# Altium project STM32F7 Dev.PrjPcb (part 1 of 2)
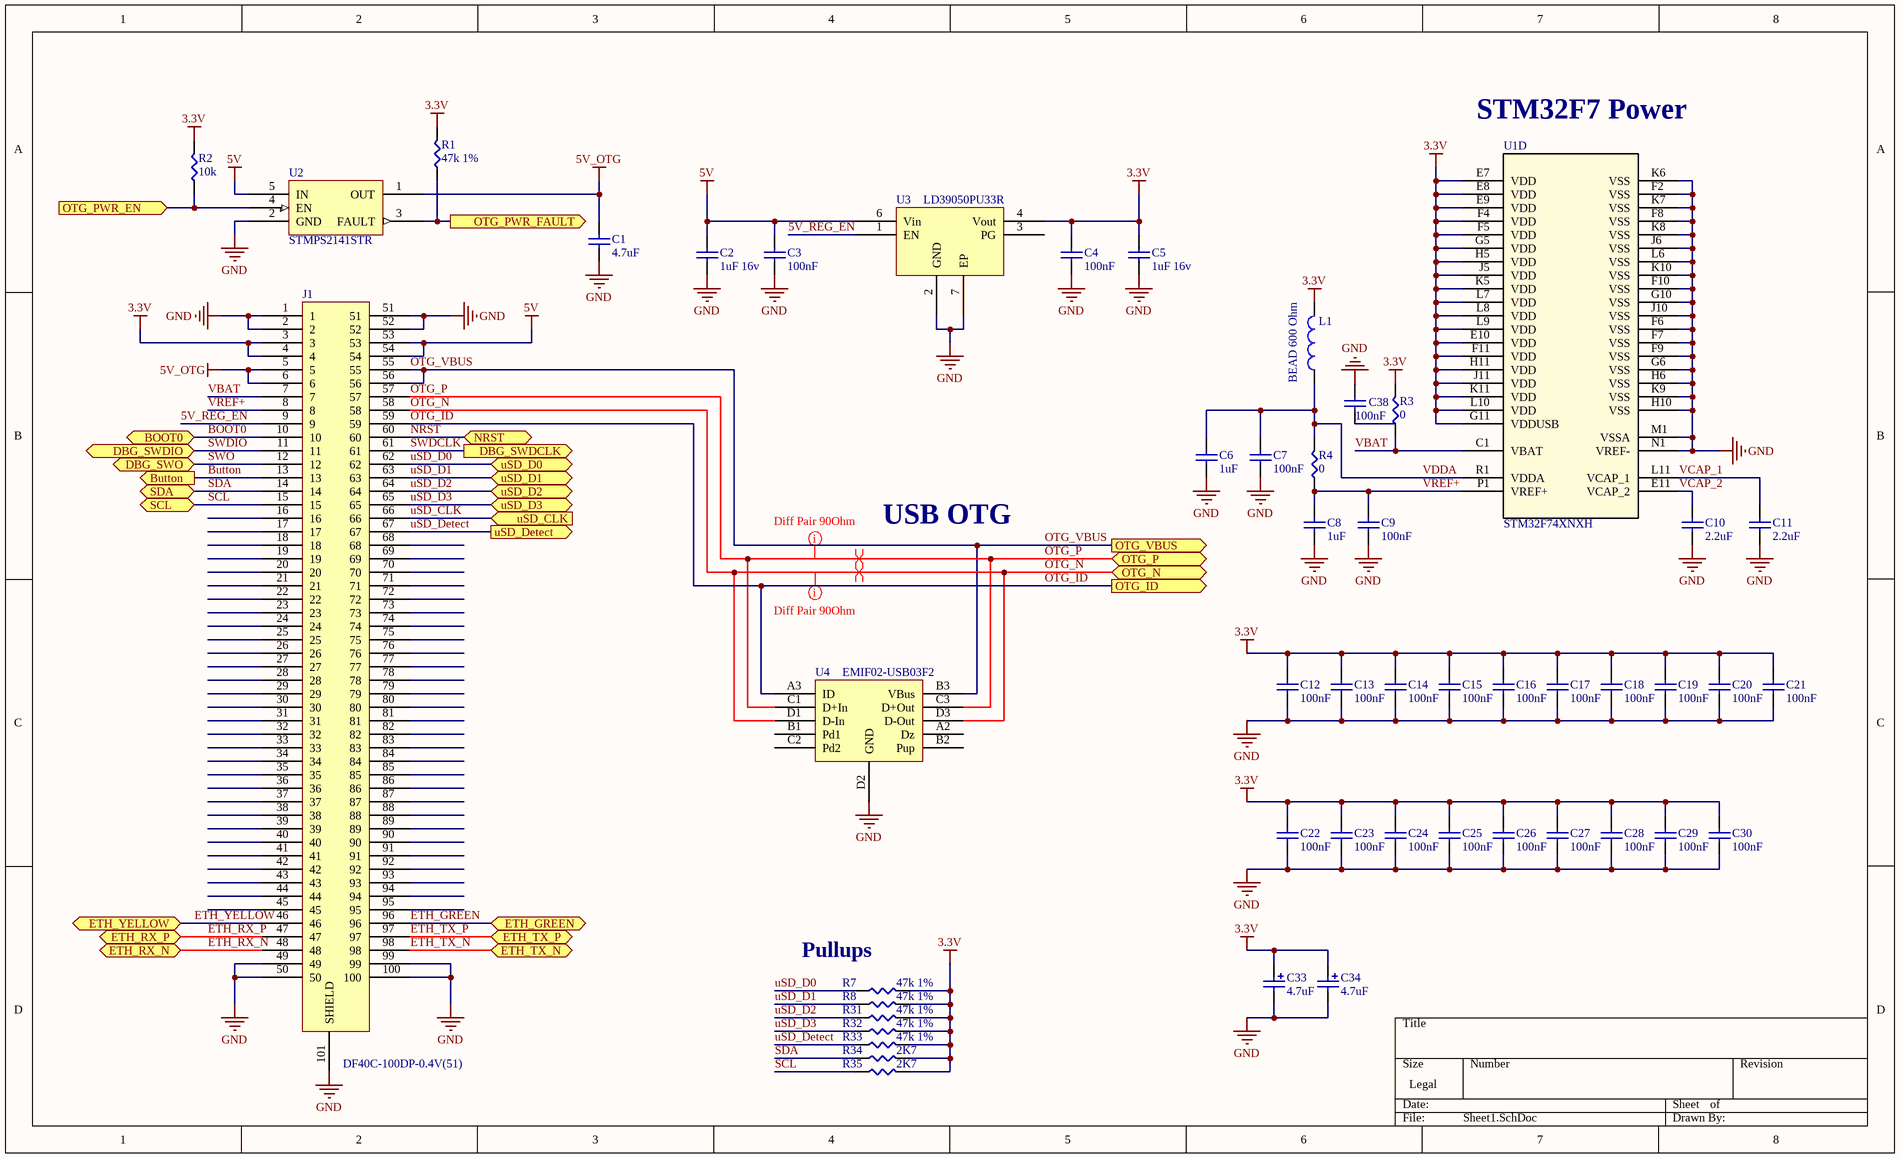
[diagram p0: Sheet1.SchDoc]
3 sheets, 98 parts. Net scope: flat (ports and power ports of the same name join across sheets).
Board file: PCB1.PcbDoc
Sheets:
  Sheet1.SchDoc
  Sheet2.SchDoc
  Sheet3.SchDoc

## Sheet Sheet1.SchDoc
size Legal

### Parts
C1  4.7uF  [CAP0603X055M]
C2  1uF 16v  [CAP0603X055M]
C3  100nF  [CAP0402X04M]
C4  100nF  [CAP0402X04M]
C5  1uF 16v  [CAP0603X055M]
C6  1uF  [CAP0402X04M]
C7  100nF  [CAP0402X04M]
C8  1uF  [CAP0402X04M]
C9  100nF  [CAP0402X04M]
C10  2.2uF  [CAP0402X04ROUND]
C11  2.2uF  [CAP0402X04ROUND]
C12  100nF  [CAP0402X04ROUND]
C13  100nF  [CAP0402X04ROUND]
C14  100nF  [CAP0402X04ROUND]
C15  100nF  [CAP0402X04ROUND]
C16  100nF  [CAP0402X04ROUND]
C17  100nF  [CAP0402X04ROUND]
C18  100nF  [CAP0402X04ROUND]
C19  100nF  [CAP0402X04ROUND]
C20  100nF  [CAP0402X04ROUND]
C21  100nF  [CAP0402X04ROUND]
C22  100nF  [CAP0402X04ROUND]
C23  100nF  [CAP0402X04ROUND]
C24  100nF  [CAP0402X04ROUND]
C25  100nF  [CAP0402X04ROUND]
C26  100nF  [CAP0402X04ROUND]
C27  100nF  [CAP0402X04ROUND]
C28  100nF  [CAP0402X04ROUND]
C29  100nF  [CAP0402X04ROUND]
C30  100nF  [CAP0402X04ROUND]
C33  4.7uF  [CAPPOL0805X07N]
C34  4.7uF  [CAPPOL0805X07N]
C38  100nF  [CAP0402X04M]
J1  DF40C-100DP-0.4V(51)  [DF40C-100DP-0.4V(51)]
L1  BEAD 600 Ohm  [IND0603X055M]
R1  47k 1%  [RES0402X04M]
R2  10k  [RES0402X04M]
R3  0  [RES0805X07M]
R4  0  [RES0805X07M]
R7  47k 1%  [RES0402X04M]
R8  47k 1%  [RES0402X04M]
R31  47k 1%  [RES0402X04M]
R32  47k 1%  [RES0402X04M]
R33  47k 1%  [RES0402X04M]
R34  2K7  [RES0402X04M]
R35  2K7  [RES0402X04M]
U1  STM32F74XNXH  [TFBGA-216_13X13]  (part D of 5)
U2  STMPS2141STR  [SOT95P280X145-5N]
U3  LD39050PU33R  [LD39050]
U4  EMIF02-USB03F2  [EMIF02-USB03F2]

### Ports
BOOT0 (bidir), Button (out), DBG_SWDCLK (out), DBG_SWDIO (bidir), DBG_SWO (bidir), ETH_GREEN (bidir), ETH_RX_N (bidir), ETH_RX_P (bidir), ETH_TX_N (bidir), ETH_TX_P (bidir), ETH_YELLOW (bidir), NRST (bidir), OTG_ID (out), OTG_N (bidir), OTG_P (bidir), OTG_PWR_EN (in), OTG_PWR_FAULT (out), OTG_VBUS (out), SCL (bidir), SDA (bidir), uSD_CLK (in), uSD_D0 (bidir), uSD_D1 (bidir), uSD_D2 (bidir), uSD_D3 (bidir), uSD_Detect (out)

### Nets
3.3V: C4.2 C5.2 C12.2 C13.2 C14.2 C15.2 C16.2 C17.2 C18.2 C19.2 C20.2 C21.2 C22.2 C23.2 C24.2 C25.2 C26.2 C27.2 C28.2 C29.2 C30.2 C33.1 C34.1 J1.3 J1.4 L1.2 R1.2 R2.2 R3.2 R7.2 R8.2 R31.2 R32.2 R33.2 R34.2 R35.2 U1.E7(VDD) U1.E8(VDD) U1.E9(VDD) U1.E10(VDD) U1.F4(VDD) U1.F5(VDD) U1.F11(VDD) U1.G5(VDD) U1.G11(VDDUSB) U1.H5(VDD) U1.H11(VDD) U1.J5(VDD) U1.J11(VDD) U1.K5(VDD) U1.K11(VDD) U1.L7(VDD) U1.L8(VDD) U1.L9(VDD) U1.L10(VDD) U3.4(Vout)
5V: C2.2 C3.2 J1.53 J1.54 U2.5(IN) U3.6(Vin)
5V_OTG: C1.2 J1.5 J1.6 U2.1(OUT)
GND: C1.1 C2.1 C3.1 C4.1 C5.1 C6.1 C7.1 C8.1 C9.1 C10.1 C11.1 C12.1 C13.1 C14.1 C15.1 C16.1 C17.1 C18.1 C19.1 C20.1 C21.1 C22.1 C23.1 C24.1 C25.1 C26.1 C27.1 C28.1 C29.1 C30.1 C33.2 C34.2 C38.2 J1.1 J1.2 J1.49 J1.50 J1.51 J1.52 J1.99 J1.100 J1.101(SHIELD) U1.F2(VSS) U1.F6(VSS) U1.F7(VSS) U1.F8(VSS) U1.F9(VSS) U1.F10(VSS) U1.G6(VSS) U1.G10(VSS) U1.H6(VSS) U1.H10(VSS) U1.J6(VSS) U1.J10(VSS) U1.K6(VSS) U1.K7(VSS) U1.K8(VSS) U1.K9(VSS) U1.K10(VSS) U1.L6(VSS) U1.M1(VSSA) U1.N1(VREF-) U2.2(GND) U3.2(GND) U3.7(EP) U4.D2(GND)
5V_REG_EN: J1.9 U3.1(EN)
BOOT0: J1.10 ; port BOOT0
Button: J1.13 ; port Button
ETH_GREEN: J1.96 ; port ETH_GREEN
ETH_RX_N: J1.48 ; port ETH_RX_N
ETH_RX_P: J1.47 ; port ETH_RX_P
ETH_TX_N: J1.98 ; port ETH_TX_N
ETH_TX_P: J1.97 ; port ETH_TX_P
ETH_YELLOW: J1.46 ; port ETH_YELLOW
NRST: J1.60 ; port NRST
OTG_ID: J1.59 U4.A3(ID) ; port OTG_ID
OTG_N: J1.58 U4.D1(D-In) U4.D3(D-Out) ; port OTG_N
OTG_P: J1.57 U4.C1(D+In) U4.C3(D+Out) ; port OTG_P
OTG_PWR_EN: R2.1 U2.4(EN) ; port OTG_PWR_EN
OTG_PWR_FAULT: R1.1 U2.3(FAULT) ; port OTG_PWR_FAULT
OTG_VBUS: J1.55 J1.56 U4.B3(VBus) ; port OTG_VBUS
SCL: J1.15 R35.1 ; port SCL
SDA: J1.14 R34.1 ; port SDA
SWDCLK: J1.61 ; port DBG_SWDCLK
SWDIO: J1.11 ; port DBG_SWDIO
SWO: J1.12 ; port DBG_SWO
uSD_CLK: J1.66 ; port uSD_CLK
uSD_D0: J1.62 R7.1 ; port uSD_D0
uSD_D1: J1.63 R8.1 ; port uSD_D1
uSD_D2: J1.64 R31.1 ; port uSD_D2
uSD_D3: J1.65 R32.1 ; port uSD_D3
uSD_Detect: J1.67 R33.1 ; port uSD_Detect
VBAT: J1.7 R3.1 U1.C1(VBAT)
VCAP_1: C11.2 U1.L11(VCAP_1)
VCAP_2: C10.2 U1.E11(VCAP_2)
VDDA: C6.2 C7.2 L1.1 R4.2 U1.R1(VDDA)
VREF+: C8.2 C9.2 J1.8 R4.1 U1.P1(VREF+)

Not connected (* = marked no-connect by the designer): C38 1; J1 16 17 18 19 20 21 22 23 24 25 26 27 28 29 30 31 32 33 34 35 36 37 38 39 40 41 42 43 44 45 68 69 70 71 72 73 74 75 76 77 78 79 80 81 82 83 84 85 86 87 88 89 90 91 92 93 94 95; U3 3(PG); U4 A2(Dz) B1(Pd1) B2(Pup) C2(Pd2)

### Layout directives
differential pair: OTG_N, OTG_P
DiffPair90: Undefined: OTG_N, OTG_P

### Notes on the sheet
- STM32F7 Power
- USB OTG
- Pullups

### Library data of the parts
C1 = CL10A475MP5LNNC: CAP CER 4.7UF 10V X5R 0603; Manufacturer: Samsung Electro-Mechanics America, Inc.; Capacitance: 4.7µF; Tolerance: ±20%; Supplier 1: Digi-Key; Manufacturer Part Number: CL10A475MP5LNNC; RoHS: RoHS Compliant; Category: Capacitors; Stock 1: 31898; Pricing 1: 1=0.1, 10=0.074, 25=0.0544, 50=0.0422, 100=0.0349, 250=0.02892, 500=0.0245, 1000=0.02028 (USD); Packaging: Cut Tape (CT); Part Status: Active; Voltage - Rated: 10V; Temperature Coefficient: X5R; Operating Temperature: -55°C ~ 85°C; Features: Low Profile; Ratings: -; Applications: General Purpose; Failure Rate: *; Mounting Type: Surface Mount, MLCC; Package / Case: 0603 (1608 Metric); Size / Dimension: 0.063" L x 0.031" W (1.60mm x 0.80mm); Height - Seated (Max): -; Thickness (Max): 0.022" (0.55mm); Lead Spacing: -; Lead Style: -; ComponentLink1URL: http://www.samsungsem.com/kr/support/library/product-catalog/__icsFiles/afieldfile/2016/09/27/MLCC.pdf; ComponentLink1Description: http://www.samsungsem.com/kr/support/library/product-catalog/__icsFiles/afieldfile/2016/09/27/MLCC.pdf; Supplier Part Number 1: 1276-6684-1-ND
C2 C5 = CC0603ZRY5V7BB105: CAP CER 1UF 16V Y5V 0603; Manufacturer: Yageo; Capacitance: 1µF; Tolerance: -20%, +80%; Temperature Coefficient: Y5V (F); Supplier 1: Digi-Key; Manufacturer Part Number: CC0603ZRY5V7BB105; RoHS: RoHS Compliant; Category: Capacitors; Stock 1: 840235; Pricing 1: 1=0.1, 10=0.033, 25=0.0236, 100=0.0152, 250=0.01248, 500=0.01068, 1000=0.00832 (USD); Packaging: Cut Tape (CT); Part Status: Active; Voltage - Rated: 16V; Operating Temperature: -30°C ~ 85°C; Features: -; Ratings: -; Applications: General Purpose; Failure Rate: -; Mounting Type: Surface Mount, MLCC; Package / Case: 0603 (1608 Metric); Size / Dimension: 0.063" L x 0.031" W (1.60mm x 0.80mm); Height - Seated (Max): -; Thickness (Max): 0.035" (0.90mm); Lead Spacing: -; Lead Style: -; ComponentLink1URL: http://www.yageo.com/documents/recent/UPY-GPHC_Y5V_6.3V-to-50V_6.pdf; ComponentLink1Description: http://www.yageo.com/documents/recent/UPY-GPHC_Y5V_6.3V-to-50V_6.pdf; Supplier Part Number 1: 311-1372-1-ND
C3 C4 C7 C9 C12-C30 C38 = GRM155R71C104KA88J: CAP CER 0.1UF 16V X7R 0402; Manufacturer: Murata Electronics North America; Capacitance: 0.10µF; Tolerance: ±10%; Supplier 1: Digi-Key; Manufacturer Part Number: GRM155R71C104KA88J; RoHS: RoHS Compliant; Category: Capacitors; Stock 1: 28696221; Pricing 1: 1=0.1, 10=0.012, 50=0.0066, 100=0.0055, 250=0.00452, 500=0.00386, 1000=0.003, 5000=0.0025, 10000=0.0023 (USD); Packaging: Cut Tape (CT); Part Status: Active; Voltage - Rated: 16V; Temperature Coefficient: X7R; Operating Temperature: -55°C ~ 125°C; Features: -; Ratings: -; Applications: General Purpose; Failure Rate: *; Mounting Type: Surface Mount, MLCC; Package / Case: 0402 (1005 Metric); Size / Dimension: 0.039" L x 0.020" W (1.00mm x 0.50mm); Height - Seated (Max): -; Thickness (Max): 0.022" (0.55mm); Lead Spacing: -; Lead Style: *; ComponentLink1URL: http://www.murata.com/~/media/webrenewal/support/library/catalog/products/capacitor/mlcc/c02e.pdf; ComponentLink1Description: http://www.murata.com/~/media/webrenewal/support/library/catalog/products/capacitor/mlcc/c02e.pdf; Supplier Part Number 1: 490-6328-1-ND
C6 C8 = GRM155R60J105KE19D: CAP CER 1UF 6.3V X5R 0402; Manufacturer: Murata Electronics North America; Capacitance: 1µF; Tolerance: ±10%; Supplier 1: Digi-Key; Manufacturer Part Number: GRM155R60J105KE19D; RoHS: RoHS Compliant; Category: Capacitors; Stock 1: 3970482; Pricing 1: 1=0.1, 10=0.021, 50=0.0114, 100=0.0096, 250=0.00784, 500=0.0067, 1000=0.00522, 5000=0.00435 (USD); Packaging: Cut Tape (CT); Part Status: Active; Voltage - Rated: 6.3V; Temperature Coefficient: X5R; Operating Temperature: -55°C ~ 85°C; Features: -; Ratings: -; Applications: General Purpose; Failure Rate: *; Mounting Type: Surface Mount, MLCC; Package / Case: 0402 (1005 Metric); Size / Dimension: 0.039" L x 0.020" W (1.00mm x 0.50mm); Height - Seated (Max): -; Thickness (Max): 0.022" (0.55mm); Lead Spacing: -; Lead Style: -; ComponentLink1URL: http://www.murata.com/~/media/webrenewal/support/library/catalog/products/capacitor/mlcc/c02e.pdf; ComponentLink1Description: http://www.murata.com/~/media/webrenewal/support/library/catalog/products/capacitor/mlcc/c02e.pdf; Supplier Part Number 1: 490-1320-1-ND
C10 C11 = 04026D225KAT2A: CAP CER 2.2UF 6.3V X5R 0402; Manufacturer: AVX Corporation; Capacitance: 2.2µF; Tolerance: ±10%; Supplier 1: Digi-Key; Manufacturer Part Number: 04026D225KAT2A; RoHS: RoHS Compliant; Category: Capacitors; Stock 1: 639807; Pricing 1: 1=0.1, 10=0.075, 25=0.0544, 50=0.0424, 100=0.0351, 250=0.029, 500=0.02458, 1000=0.02035, 5000=0.01733 (USD); Packaging: Cut Tape (CT); Part Status: Active; Voltage - Rated: 6.3V; Temperature Coefficient: X5R; Operating Temperature: -55°C ~ 85°C; Features: -; Ratings: -; Applications: General Purpose; Failure Rate: *; Mounting Type: Surface Mount, MLCC; Package / Case: 0402 (1005 Metric); Size / Dimension: 0.039" L x 0.020" W (1.00mm x 0.50mm); Height - Seated (Max): -; Thickness (Max): 0.022" (0.56mm); Lead Spacing: -; Lead Style: -; ComponentLink1URL: http://datasheets.avx.com/cx5r.pdf; ComponentLink1Description: http://datasheets.avx.com/cx5r.pdf; Supplier Part Number 1: 478-7885-1-ND
C33 C34 = F921A475MPA: CAP TANT 4.7UF 10V 20% 0805; Manufacturer: AVX Corporation; Manufacturer Size Code: P; Capacitance: 4.7µF; Type: Molded; ESR (Equivalent Series Resistance): 6 Ohm; Supplier 1: Digi-Key; Manufacturer Part Number: F921A475MPA; RoHS: RoHS Compliant; Category: Capacitors; Stock 1: 10365; Pricing 1: 1=0.29, 10=0.204, 25=0.1672, 50=0.1426, 100=0.1223, 250=0.10192, 500=0.09174, 1000=0.07746 (USD); Packaging: Cut Tape (CT); Part Status: Active; Tolerance: ±20%; Voltage - Rated: 10V; Operating Temperature: -55°C ~ 125°C; Lifetime @ Temp.: -; Mounting Type: Surface Mount; Package / Case: 0805 (2012 Metric); Size / Dimension: 0.079" L x 0.049" W (2.00mm x 1.25mm); Height - Seated (Max): 0.039" (1.00mm); Lead Spacing: -; Features: General Purpose; Failure Rate: -; ComponentLink1URL: http://datasheets.avx.com/f92.pdf; ComponentLink1Description: http://datasheets.avx.com/f92.pdf; Supplier Part Number 1: 478-8125-1-ND
J1 = DF40C-100DP-0.4V(51): CONN HDR 100POS 0.4MM SMD GOLD; Manufacturer: Hirose Electric Co Ltd; Connector Type: Plug, Outer Shroud Contacts; Number of Positions: 100; Pitch: 0.016" (0.40mm); Mated Stacking Heights: 1.5mm, 2mm, 2.5mm, 3mm, 3.5mm, 4mm; Supplier 1: Digi-Key; Manufacturer Part Number: DF40C-100DP-0.4V(51); RoHS: RoHS Compliant; Category: Connectors, Interconnects; Stock 1: 15710; Pricing 1: 1=1.66, 10=1.509, 25=1.4168, 50=1.3552, 100=1.2936, 250=1.1704, 500=1.078, 1000=0.924, 2500=0.8624 (USD); Packaging: Cut Tape (CT); Part Status: Active; Number of Rows: 2; Mounting Type: Surface Mount; Features: Solder Retention; Contact Finish: Gold; Contact Finish Thickness: 2µin (0.05µm); Height Above Board: 0.045" (1.14mm); ComponentLink1URL: https://www.hirose.com/product/download/?distributor=digikey&type=2d&lang=en&num=DF40C-100DP-0.4V(51); ComponentLink1Description: https://www.hirose.com/product/download/?distributor=digikey&type=2d&lang=en&num=DF40C-100DP-0.4V(51); Supplier Part Number 1: H11614CT-ND
L1 = BK1608HW601-T: FERRITE BEAD 600 OHM 0603 1LN; Manufacturer: Taiyo Yuden; Number of Lines: 1; Impedance @ Frequency: 600 Ohm @ 100MHz; Current Rating (Max): 300mA; DC Resistance (DCR) (Max): 400 mOhm; Supplier 1: Digi-Key; Manufacturer Part Number: BK1608HW601-T; RoHS: RoHS Compliant; Category: Filters; Stock 1: 46168; Pricing 1: 1=0.1, 10=0.059, 50=0.0474, 100=0.0426, 250=0.0312, 500=0.0227, 1000=0.02223 (USD); Packaging: Cut Tape (CT); Part Status: Active; Filter Type: -; Ratings: -; Operating Temperature: -55°C ~ 125°C; Package / Case: 0603 (1608 Metric); Mounting Type: Surface Mount; Height (Max): 0.037" (0.95mm); Size / Dimension: 0.063" L x 0.031" W (1.60mm x 0.80mm); ComponentLink1URL: http://ds.yuden.co.jp/TYCOMPAS/ut/detail.do?productNo=BK1608HW601-T&fileName=BK1608HW601-T_SS&mode=specSheetDownload; ComponentLink1Description: http://ds.yuden.co.jp/TYCOMPAS/ut/detail.do?productNo=BK1608HW601-T&fileName=BK1608HW601-T_SS&mode=specSheetDownload; Supplier Part Number 1: 587-1879-1-ND
R1 R7 R8 R31-R33 = ERJ-2RKF4702X: RES SMD 47K OHM 1% 1/10W 0402; Manufacturer: Panasonic Electronic Components; Power (Watts): 0.1W, 1/10W; Temperature Coefficient: ±100ppm/°C; Supplier 1: Digi-Key; Manufacturer Part Number: ERJ-2RKF4702X; RoHS: RoHS Compliant; Category: Resistors; Stock 1: 296471; Pricing 1: 1=0.1, 50=0.015, 100=0.011, 250=0.0084, 500=0.00674, 1000=0.00496, 5000=0.00355 (USD); Packaging: Cut Tape (CT); Part Status: Active; Resistance (Ohms): 47k; Tolerance: ±1%; Composition: Thick Film; Features: Automotive AEC-Q200; Operating Temperature: -55°C ~ 155°C; Package / Case: 0402 (1005 Metric); Supplier Device Package: 0402; Size / Dimension: 0.039" L x 0.020" W (1.00mm x 0.50mm); Height - Seated (Max): 0.016" (0.40mm); Number of Terminations: 2; Failure Rate: -; ComponentLink1URL: http://industrial.panasonic.com/www-cgi/jvcr13pz.cgi?E+PZ+3+AOA0002+ERJ2RKF4702X+7+WW; ComponentLink1Description: http://industrial.panasonic.com/www-cgi/jvcr13pz.cgi?E+PZ+3+AOA0002+ERJ2RKF4702X+7+WW; Supplier Part Number 1: P47.0KLCT-ND
R2 = RC0402FR-0710KL: RES SMD 10K OHM 1% 1/16W 0402; Manufacturer: Yageo; Power (Watts): 0.063W, 1/16W; Temperature Coefficient: ±100ppm/°C; Supplier 1: Digi-Key; Manufacturer Part Number: RC0402FR-0710KL; RoHS: RoHS Compliant; Category: Resistors; Stock 1: 13115833; Pricing 1: 1=0.1, 10=0.013, 25=0.0096, 100=0.0054, 250=0.00412, 500=0.00328, 1000=0.00242, 2500=0.0021, 5000=0.00173 (USD); Packaging: Cut Tape (CT); Part Status: Active; Resistance (Ohms): 10k; Tolerance: ±1%; Composition: Thick Film; Features: Moisture Resistant; Operating Temperature: -55°C ~ 155°C; Package / Case: 0402 (1005 Metric); Supplier Device Package: 0402; Size / Dimension: 0.039" L x 0.020" W (1.00mm x 0.50mm); Height - Seated (Max): 0.016" (0.40mm); Number of Terminations: 2; Failure Rate: -; ComponentLink1URL: http://www.yageo.com/NewPortal/yageodocoutput?fileName=/pdf/R-Chip/PYu-RC_Group_51_RoHS_L_4.pdf; ComponentLink1Description: http://www.yageo.com/NewPortal/yageodocoutput?fileName=/pdf/R-Chip/PYu-RC_Group_51_RoHS_L_4.pdf; Supplier Part Number 1: 311-10.0KLRCT-ND
R3 R4 = RC0805JR-070RL: RES SMD 0.0 OHM JUMPER 1/8W 0805; Manufacturer: Yageo; Resistance (Ohms): 0.0; Power (Watts): 0.125W, 1/8W; Supplier 1: Digi-Key; Manufacturer Part Number: RC0805JR-070RL; RoHS: RoHS Compliant; Category: Resistors; Stock 1: 2486712; Pricing 1: 1=0.1, 10=0.018, 25=0.0128, 100=0.0073, 250=0.00556, 500=0.00444, 1000=0.00326, 2500=0.00283 (USD); Packaging: Cut Tape (CT); Part Status: Active; Tolerance: Jumper; Composition: Thick Film; Features: Moisture Resistant; Temperature Coefficient: -; Operating Temperature: -55°C ~ 155°C; Package / Case: 0805 (2012 Metric); Supplier Device Package: 0805; Size / Dimension: 0.079" L x 0.049" W (2.00mm x 1.25mm); Height - Seated (Max): 0.024" (0.60mm); Number of Terminations: 2; Failure Rate: -; ComponentLink1URL: http://www.yageo.com/NewPortal/yageodocoutput?fileName=/pdf/R-Chip/PYu-RC_Group_51_RoHS_L_4.pdf; ComponentLink1Description: http://www.yageo.com/NewPortal/yageodocoutput?fileName=/pdf/R-Chip/PYu-RC_Group_51_RoHS_L_4.pdf; Supplier Part Number 1: 311-0.0ARCT-ND
R34 R35 = ERJ-2RKF2701X: RES SMD 2.7K OHM 1% 1/10W 0402; Manufacturer: Panasonic Electronic Components; Power (Watts): 0.1W, 1/10W; Temperature Coefficient: ±100ppm/°C; Supplier 1: Digi-Key; Manufacturer Part Number: ERJ-2RKF2701X; RoHS: RoHS Compliant; Category: Resistors; Stock 1: 285382; Pricing 1: 1=0.1, 50=0.015, 100=0.011, 250=0.0084, 500=0.00674, 1000=0.00496, 5000=0.00355 (USD); Packaging: Cut Tape (CT); Part Status: Active; Resistance (Ohms): 2.7k; Tolerance: ±1%; Composition: Thick Film; Features: Automotive AEC-Q200; Operating Temperature: -55°C ~ 155°C; Package / Case: 0402 (1005 Metric); Supplier Device Package: 0402; Size / Dimension: 0.039" L x 0.020" W (1.00mm x 0.50mm); Height - Seated (Max): 0.016" (0.40mm); Number of Terminations: 2; Failure Rate: -; ComponentLink1URL: http://industrial.panasonic.com/www-cgi/jvcr13pz.cgi?E+PZ+3+AOA0002+ERJ2RKF2701X+7+WW; ComponentLink1Description: http://industrial.panasonic.com/www-cgi/jvcr13pz.cgi?E+PZ+3+AOA0002+ERJ2RKF2701X+7+WW; Supplier Part Number 1: P2.70KLCT-ND
U1 = STM32F74XNXH: Imported; Manufacturer Part Number: STM32F746NGH6; Vendor: STMicroelectronics; C: Copyright (C) 2016 Accelerated Designs. All rights reserved; Core Processor: ARM® Cortex®-M7; Core Size: 32-Bit; Speed: 216MHz; Connectivity: CAN, EBI/EMI, Ethernet, I²C, IrDA, LIN, SAI, SD, SPDIF-Rx, SPI, UART/USART, USB OTG; Peripherals: Brown-out Detect/Reset, DMA, I²S, LCD, POR, PWM, WDT; Number of I/O: 168; Program Memory Size: 1MB (1M x 8); Program Memory Type: FLASH; RAM Size: 320K x 8; Voltage - Supply (Vcc/Vdd): 1.7 V ~ 3.6 V; Data Converters: A/D 24x12b, D/A 2x12b; Oscillator Type: Internal; Copyright: Copyright (C) 2016 Accelerated Designs. All rights reserved; RefDes: RefDes; Type: Type; Value: Value; Supplier 1: Digi-Key; Manufacturer: STMicroelectronics; RoHS: RoHS Compliant; Category: Integrated Circuits (ICs); Stock 1: 825; Pricing 1: 1=17.07, 10=15.687, 100=13.2486, 500=11.7856 (USD); Packaging: Tray; Part Status: Active; EEPROM Size: -; Operating Temperature: -40°C ~ 85°C (TA); Package / Case: 216-TFBGA; Supplier Device Package: 216-TFBGA (13x13); ComponentLink1Description: http://www.st.com/content/ccc/resource/technical/document/datasheet/96/ed/61/9b/e0/6c/45/0b/DM00166116.pdf/files/DM00166116.pdf/jcr:content/translations/en.DM00166116.pdf; Supplier Part Number 1: 497-15818-ND
U2 = STMPS2141STR: IC PWR SWITCH 1CH 500MA SOT23-5; Manufacturer: STMicroelectronics; Switch Type: General Purpose; Number of Outputs: 1; Ratio - Input:Output: 1:1; Output Configuration: High Side; Output Type: N-Channel; Interface: On/Off; Voltage - Load: 2.7 V ~ 5.5 V; Voltage - Supply (Vcc/Vdd): Not Required; Rds On (Typ): 90 mOhm; Input Type: Non-Inverting; Fault Protection: Current Limiting (Fixed), Over Temperature, Reverse Current, UVLO; Supplier 1: Digi-Key; Manufacturer Part Number: STMPS2141STR; RoHS: RoHS Compliant; Category: Integrated Circuits (ICs); Stock 1: 9855; Pricing 1: 1=0.61, 10=0.521, 100=0.3893, 500=0.30592, 1000=0.23639 (USD); Packaging: Cut Tape (CT); Part Status: Active; Current - Output (Max): 500mA; Features: -; Operating Temperature: -40°C ~ 125°C (TJ); Package / Case: SC-74A, SOT-753; Supplier Device Package: SOT-23-5; ComponentLink1URL: http://www.st.com/content/ccc/resource/technical/document/datasheet/e8/d7/48/25/eb/87/45/b3/CD00167470.pdf/files/CD00167470.pdf/jcr:content/translations/en.CD00167470.pdf; ComponentLink1Description: http://www.st.com/content/ccc/resource/technical/document/datasheet/e8/d7/48/25/eb/87/45/b3/CD00167470.pdf/files/CD00167470.pdf/jcr:content/translations/en.CD00167470.pdf; Supplier Part Number 1: 497-6933-1-ND
U3 = LD39050PU33R: IC REG LDO 3.3V 0.5A 6DFN; Manufacturer: STMicroelectronics; Regulator Topology: Positive Fixed; Current - Output: 500mA; Voltage - Dropout (Typical): 0.2V @ 500mA; Number of Regulators: 1; Voltage - Input: Up to 5.5V; Supplier 1: Digi-Key; Manufacturer Part Number: LD39050PU33R; RoHS: RoHS Compliant; Category: Integrated Circuits (ICs); Stock 1: 4096; Pricing 1: 1=1.07, 10=0.957, 100=0.7462, 500=0.61646, 1000=0.48668 (USD); Packaging: Cut Tape (CT); Part Status: Active; Voltage - Output: 3.3V; Current - Limit (Min): -; Operating Temperature: -40°C ~ 125°C; Mounting Type: Surface Mount; Package / Case: 6-VDFN Exposed Pad; Supplier Device Package: 6-DFN (3x3); ComponentLink1URL: http://www.st.com/content/ccc/resource/technical/document/datasheet/12/43/cc/93/21/f6/41/66/CD00227527.pdf/files/CD00227527.pdf/jcr:content/translations/en.CD00227527.pdf; ComponentLink1Description: http://www.st.com/content/ccc/resource/technical/document/datasheet/12/43/cc/93/21/f6/41/66/CD00227527.pdf/files/CD00227527.pdf/jcr:content/translations/en.CD00227527.pdf; Supplier Part Number 1: 497-8716-1-ND
U4 = EMIF02-USB03F2: FILTER RC(PI) 33 OHM/20PF SMD; Manufacturer: STMicroelectronics; Filter Order: 2nd; Number of Channels: 2; Resistance - Channel (Ohms): 33; Values: R = 33 Ohms, C = 20pF; ESD Protection: Yes; Supplier 1: Digi-Key; Manufacturer Part Number: EMIF02-USB03F2; RoHS: RoHS Compliant; Category: Filters; Stock 1: 8918; Pricing 1: 1=0.68, 10=0.644, 100=0.4574, 500=0.39502, 1000=0.35343 (USD); Packaging: Cut Tape (CT); Part Status: Active; Type: Low Pass; Technology: RC (Pi); Center / Cutoff Frequency: -; Attenuation Value: -; Current: -; Operating Temperature: -40°C ~ 85°C; Applications: USB; Voltage - Rated: -; Mounting Type: Surface Mount; Package / Case: 11-WFBGA, FCBGA; Size / Dimension: 0.076" L x 0.057" W (1.94mm x 1.44mm); Height: 0.028" (0.70mm); ComponentLink1URL: http://www.st.com/content/ccc/resource/technical/document/datasheet/0a/25/37/a6/28/ab/4f/24/CD00042880.pdf/files/CD00042880.pdf/jcr:content/translations/en.CD00042880.pdf; ComponentLink1Description: http://www.st.com/content/ccc/resource/technical/document/datasheet/0a/25/37/a6/28/ab/4f/24/CD00042880.pdf/files/CD00042880.pdf/jcr:content/translations/en.CD00042880.pdf; Supplier Part Number 1: 497-13521-1-ND

## Sheet Sheet2.SchDoc
size Legal
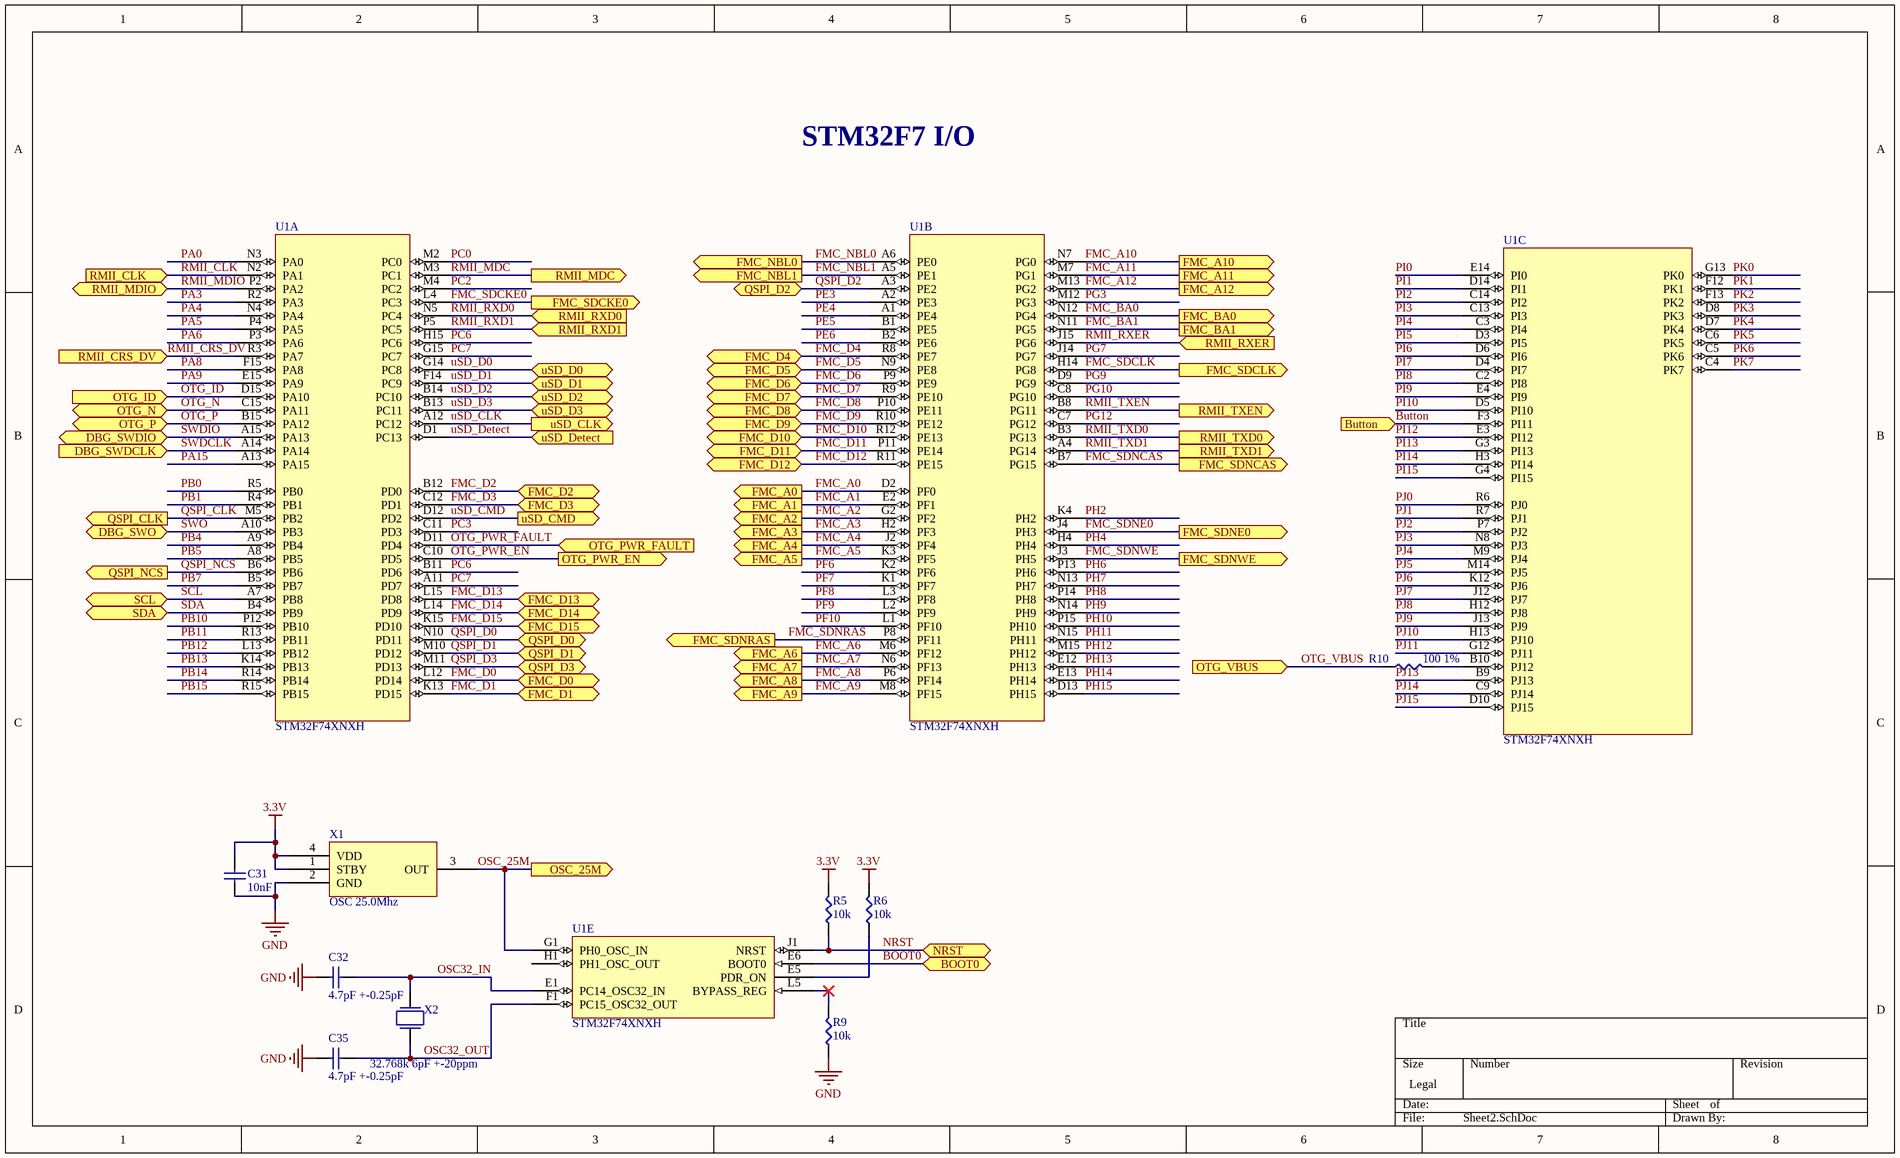
[diagram p1: Sheet2.SchDoc]

### Parts
C31  10nF  [CAP0402X04M]
C32  4.7pF +-0.25pF  [CAP0402X04M]
C35  4.7pF +-0.25pF  [CAP0402X04M]
R5  10k  [RES0402X04M]
R6  10k  [RES0402X04M]
R9  10k  [RES0402X04M]
R10  100 1%  [RES0402X04M]
U1  STM32F74XNXH  [TFBGA-216_13X13]  (parts A,B,C,E of 5)
X1  OSC 25.0Mhz  [OSC_3.2x2.5]
X2  32.768k 6pF +-20ppm  [CRYSTAL_3.20x1.50]

### Ports
BOOT0 (bidir), Button (in), DBG_SWDCLK (in), DBG_SWDIO (bidir), DBG_SWO (bidir), FMC_A0 (out), FMC_A1 (out), FMC_A2 (out), FMC_A3 (out), FMC_A4 (out), FMC_A5 (out), FMC_A6 (out), FMC_A7 (out), FMC_A8 (out), FMC_A9 (out), FMC_A10 (out), FMC_A11 (out), FMC_A12 (out), FMC_BA0 (out), FMC_BA1 (out), FMC_D0 (bidir), FMC_D1 (bidir), FMC_D2 (bidir), FMC_D3 (bidir), FMC_D4 (bidir), FMC_D5 (bidir), FMC_D6 (bidir), FMC_D7 (bidir), FMC_D8 (bidir), FMC_D9 (bidir), FMC_D10 (bidir), FMC_D11 (bidir), FMC_D12 (bidir), FMC_D13 (bidir), FMC_D14 (bidir), FMC_D15 (bidir), FMC_NBL0 (out), FMC_NBL1 (out), FMC_SDCKE0 (out), FMC_SDCLK (out), FMC_SDNCAS (out), FMC_SDNE0 (out), FMC_SDNRAS (out), FMC_SDNWE (out), NRST (bidir), OSC_25M (out), OTG_ID (in), OTG_N (bidir), OTG_P (bidir), OTG_PWR_EN (out), OTG_PWR_FAULT (in), OTG_VBUS (in), QSPI_CLK (out), QSPI_D0 (bidir), QSPI_D1 (bidir), QSPI_D2 (bidir), QSPI_D3 (bidir), QSPI_NCS (out), RMII_CLK (in), RMII_CRS_DV (in), RMII_MDC (out), RMII_MDIO (bidir), RMII_RXD0 (in), RMII_RXD1 (in), RMII_RXER (in), RMII_TXD0 (out), RMII_TXD1 (out), RMII_TXEN (out), SCL (bidir), SDA (bidir), uSD_CLK (out), uSD_CMD (out), uSD_D0 (bidir), uSD_D1 (bidir), uSD_D2 (bidir), uSD_D3 (bidir), uSD_Detect (in)

### Nets
3.3V: C31.2 R5.2 R6.2 X1.1(STBY) X1.4(VDD)
GND: C31.1 C32.1 C35.1 R9.1 X1.2(GND)
BOOT0: U1.E6(BOOT0) ; port BOOT0
Button: U1.F3(PI11) ; port Button
FMC_A0: U1.D2(PF0) ; port FMC_A0
FMC_A1: U1.E2(PF1) ; port FMC_A1
FMC_A2: U1.G2(PF2) ; port FMC_A2
FMC_A3: U1.H2(PF3) ; port FMC_A3
FMC_A4: U1.J2(PF4) ; port FMC_A4
FMC_A5: U1.K3(PF5) ; port FMC_A5
FMC_A6: U1.M6(PF12) ; port FMC_A6
FMC_A7: U1.N6(PF13) ; port FMC_A7
FMC_A8: U1.P6(PF14) ; port FMC_A8
FMC_A9: U1.M8(PF15) ; port FMC_A9
FMC_A10: U1.N7(PG0) ; port FMC_A10
FMC_A11: U1.M7(PG1) ; port FMC_A11
FMC_A12: U1.M13(PG2) ; port FMC_A12
FMC_BA0: U1.N12(PG4) ; port FMC_BA0
FMC_BA1: U1.N11(PG5) ; port FMC_BA1
FMC_D0: U1.L12(PD14) ; port FMC_D0
FMC_D1: U1.K13(PD15) ; port FMC_D1
FMC_D2: U1.B12(PD0) ; port FMC_D2
FMC_D3: U1.C12(PD1) ; port FMC_D3
FMC_D4: U1.R8(PE7) ; port FMC_D4
FMC_D5: U1.N9(PE8) ; port FMC_D5
FMC_D6: U1.P9(PE9) ; port FMC_D6
FMC_D7: U1.R9(PE10) ; port FMC_D7
FMC_D8: U1.P10(PE11) ; port FMC_D8
FMC_D9: U1.R10(PE12) ; port FMC_D9
FMC_D10: U1.R12(PE13) ; port FMC_D10
FMC_D11: U1.P11(PE14) ; port FMC_D11
FMC_D12: U1.R11(PE15) ; port FMC_D12
FMC_D13: U1.L15(PD8) ; port FMC_D13
FMC_D14: U1.L14(PD9) ; port FMC_D14
FMC_D15: U1.K15(PD10) ; port FMC_D15
FMC_NBL0: U1.A6(PE0) ; port FMC_NBL0
FMC_NBL1: U1.A5(PE1) ; port FMC_NBL1
FMC_SDCKE0: U1.L4(PC3) ; port FMC_SDCKE0
FMC_SDCLK: U1.H14(PG8) ; port FMC_SDCLK
FMC_SDNCAS: U1.B7(PG15) ; port FMC_SDNCAS
FMC_SDNE0: U1.J4(PH3) ; port FMC_SDNE0
FMC_SDNRAS: U1.P8(PF11) ; port FMC_SDNRAS
FMC_SDNWE: U1.J3(PH5) ; port FMC_SDNWE
NRST: R5.1 U1.J1(NRST) ; port NRST
OSC32_IN: C32.2 U1.E1(PC14_OSC32_IN) X2.1
OSC32_OUT: C35.2 U1.F1(PC15_OSC32_OUT) X2.2
OSC_25M: U1.G1(PH0_OSC_IN) X1.3(OUT) ; port OSC_25M
OTG_ID: U1.D15(PA10) ; port OTG_ID
OTG_N: U1.C15(PA11) ; port OTG_N
OTG_P: U1.B15(PA12) ; port OTG_P
OTG_PWR_EN: U1.C10(PD5) ; port OTG_PWR_EN
OTG_PWR_FAULT: U1.D11(PD4) ; port OTG_PWR_FAULT
OTG_VBUS: R10.1 ; port OTG_VBUS
PA0: U1.N3(PA0)
PA3: U1.R2(PA3)
PA4: U1.N4(PA4)
PA5: U1.P4(PA5)
PA6: U1.P3(PA6)
PA8: U1.F15(PA8)
PA9: U1.E15(PA9)
PA15: U1.A13(PA15)
PB0: U1.R5(PB0)
PB1: U1.R4(PB1)
PB4: U1.A9(PB4)
PB5: U1.A8(PB5)
PB7: U1.B5(PB7)
PB10: U1.P12(PB10)
PB11: U1.R13(PB11)
PB12: U1.L13(PB12)
PB13: U1.K14(PB13)
PB14: U1.R14(PB14)
PB15: U1.R15(PB15)
PC0: U1.M2(PC0)
PC2: U1.M4(PC2)
PC3: U1.C11(PD3)
PC6: U1.B11(PD6) U1.H15(PC6)
PC7: U1.A11(PD7) U1.G15(PC7)
PE3: U1.A2(PE3)
PE4: U1.A1(PE4)
PE5: U1.B1(PE5)
PE6: U1.B2(PE6)
PF6: U1.K2(PF6)
PF7: U1.K1(PF7)
PF8: U1.L3(PF8)
PF9: U1.L2(PF9)
PF10: U1.L1(PF10)
PG3: U1.M12(PG3)
PG7: U1.J14(PG7)
PG9: U1.D9(PG9)
PG10: U1.C8(PG10)
PG12: U1.C7(PG12)
PH2: U1.K4(PH2)
PH4: U1.H4(PH4)
PH6: U1.P13(PH6)
PH7: U1.N13(PH7)
PH8: U1.P14(PH8)
PH9: U1.N14(PH9)
PH10: U1.P15(PH10)
PH11: U1.N15(PH11)
PH12: U1.M15(PH12)
PH13: U1.E12(PH13)
PH14: U1.E13(PH14)
PH15: U1.D13(PH15)
PI0: U1.E14(PI0)
PI1: U1.D14(PI1)
PI2: U1.C14(PI2)
PI3: U1.C13(PI3)
PI4: U1.C3(PI4)
PI5: U1.D3(PI5)
PI6: U1.D6(PI6)
PI7: U1.D4(PI7)
PI8: U1.C2(PI8)
PI9: U1.E4(PI9)
PI10: U1.D5(PI10)
PI12: U1.E3(PI12)
PI13: U1.G3(PI13)
PI14: U1.H3(PI14)
PI15: U1.G4(PI15)
PJ0: U1.R6(PJ0)
PJ1: U1.R7(PJ1)
PJ2: U1.P7(PJ2)
PJ3: U1.N8(PJ3)
PJ4: U1.M9(PJ4)
PJ5: U1.M14(PJ5)
PJ6: U1.K12(PJ6)
PJ7: U1.J12(PJ7)
PJ8: U1.H12(PJ8)
PJ9: U1.J13(PJ9)
PJ10: U1.H13(PJ10)
PJ11: U1.G12(PJ11)
PJ13: U1.B9(PJ13)
PJ14: U1.C9(PJ14)
PJ15: U1.D10(PJ15)
PK0: U1.G13(PK0)
PK1: U1.F12(PK1)
PK2: U1.F13(PK2)
PK3: U1.D8(PK3)
PK4: U1.D7(PK4)
PK5: U1.C6(PK5)
PK6: U1.C5(PK6)
PK7: U1.C4(PK7)
QSPI_CLK: U1.M5(PB2) ; port QSPI_CLK
QSPI_D0: U1.N10(PD11) ; port QSPI_D0
QSPI_D1: U1.M10(PD12) ; port QSPI_D1
QSPI_D2: U1.A3(PE2) ; port QSPI_D2
QSPI_D3: U1.M11(PD13) ; port QSPI_D3
QSPI_NCS: U1.B6(PB6) ; port QSPI_NCS
RMII_CLK: U1.N2(PA1) ; port RMII_CLK
RMII_CRS_DV: U1.R3(PA7) ; port RMII_CRS_DV
RMII_MDC: U1.M3(PC1) ; port RMII_MDC
RMII_MDIO: U1.P2(PA2) ; port RMII_MDIO
RMII_RXD0: U1.N5(PC4) ; port RMII_RXD0
RMII_RXD1: U1.P5(PC5) ; port RMII_RXD1
RMII_RXER: U1.J15(PG6) ; port RMII_RXER
RMII_TXD0: U1.B3(PG13) ; port RMII_TXD0
RMII_TXD1: U1.A4(PG14) ; port RMII_TXD1
RMII_TXEN: U1.B8(PG11) ; port RMII_TXEN
SCL: U1.A7(PB8) ; port SCL
SDA: U1.B4(PB9) ; port SDA
SWDCLK: U1.A14(PA14) ; port DBG_SWDCLK
SWDIO: U1.A15(PA13) ; port DBG_SWDIO
SWO: U1.A10(PB3) ; port DBG_SWO
uSD_CLK: U1.A12(PC12) ; port uSD_CLK
uSD_CMD: U1.D12(PD2) ; port uSD_CMD
uSD_D0: U1.G14(PC8) ; port uSD_D0
uSD_D1: U1.F14(PC9) ; port uSD_D1
uSD_D2: U1.B14(PC10) ; port uSD_D2
uSD_D3: U1.B13(PC11) ; port uSD_D3
uSD_Detect: U1.D1(PC13) ; port uSD_Detect
NetR6_1: R6.1 U1.E5(PDR_ON)
NetR9_2: R9.2 U1.L5(BYPASS_REG)
NetR10_2: R10.2 U1.B10(PJ12)

Not connected (* = marked no-connect by the designer): U1 H1(PH1_OSC_OUT)

### Notes on the sheet
- STM32F7 I/O

### Library data of the parts
C31 = GRM155R71H103KA88D: CAP CER 10000PF 50V X7R 0402; Manufacturer: Murata Electronics North America; Tolerance: ±10%; Supplier 1: Digi-Key; Manufacturer Part Number: GRM155R71H103KA88D; RoHS: RoHS Compliant; Category: Capacitors; Stock 1: 4828857; Pricing 1: 1=0.1, 50=0.0052, 100=0.0044, 250=0.0036, 500=0.00308, 1000=0.0024, 5000=0.002 (USD); Packaging: Cut Tape (CT); Part Status: Active; Capacitance: 10000pF; Voltage - Rated: 50V; Temperature Coefficient: X7R; Operating Temperature: -55°C ~ 125°C; Features: -; Ratings: -; Applications: General Purpose; Failure Rate: *; Mounting Type: Surface Mount, MLCC; Package / Case: 0402 (1005 Metric); Size / Dimension: 0.039" L x 0.020" W (1.00mm x 0.50mm); Height - Seated (Max): -; Thickness (Max): 0.022" (0.55mm); Lead Spacing: -; Lead Style: -; ComponentLink1URL: http://www.murata.com/~/media/webrenewal/support/library/catalog/products/capacitor/mlcc/c02e.pdf; ComponentLink1Description: http://www.murata.com/~/media/webrenewal/support/library/catalog/products/capacitor/mlcc/c02e.pdf; Supplier Part Number 1: 490-4516-1-ND
C32 C35 = CL05C4R7CB5NNNC: CAP CER 4.7PF 50V NP0 0402; Manufacturer: Samsung Electro-Mechanics America, Inc.; Tolerance: ±0.25pF; Temperature Coefficient: C0G, NP0; Supplier 1: Digi-Key; Manufacturer Part Number: CL05C4R7CB5NNNC; RoHS: RoHS Compliant; Category: Capacitors; Stock 1: 159620; Pricing 1: 1=0.1, 10=0.015, 25=0.0112, 50=0.0084, 100=0.0069, 250=0.00576, 500=0.0049, 1000=0.00385, 5000=0.00322 (USD); Packaging: Cut Tape (CT); Part Status: Active; Capacitance: 4.7pF; Voltage - Rated: 50V; Operating Temperature: -55°C ~ 125°C; Features: -; Ratings: -; Applications: General Purpose; Failure Rate: *; Mounting Type: Surface Mount, MLCC; Package / Case: 0402 (1005 Metric); Size / Dimension: 0.039" L x 0.020" W (1.00mm x 0.50mm); Height - Seated (Max): -; Thickness (Max): 0.022" (0.55mm); Lead Spacing: -; Lead Style: -; ComponentLink1URL: http://www.samsungsem.com/kr/support/product-search/mlcc/__icsFiles/afieldfile/2016/08/18/S_CL05C4R7CB5NNNC.pdf; ComponentLink1Description: http://www.samsungsem.com/kr/support/product-search/mlcc/__icsFiles/afieldfile/2016/08/18/S_CL05C4R7CB5NNNC.pdf; Supplier Part Number 1: 1276-1703-1-ND
R5 R6 R9 = RC0402FR-0710KL: as R2 on sheet Sheet1; Supplier 1: Digi-Key; Manufacturer Part Number: RC0402FR-0710KL; RoHS: RoHS Compliant; Category: Resistors; Stock 1: 13115833; Pricing 1: 1=0.1, 10=0.013, 25=0.0096, 100=0.0054, 250=0.00412, 500=0.00328, 1000=0.00242, 2500=0.0021, 5000=0.00173 (USD); Packaging: Cut Tape (CT); Part Status: Active; Resistance (Ohms): 10k; Tolerance: ±1%; Composition: Thick Film; Features: Moisture Resistant; Operating Temperature: -55°C ~ 155°C; Package / Case: 0402 (1005 Metric); Supplier Device Package: 0402; Size / Dimension: 0.039" L x 0.020" W (1.00mm x 0.50mm); Height - Seated (Max): 0.016" (0.40mm); Number of Terminations: 2; Failure Rate: -; ComponentLink1URL: http://www.yageo.com/NewPortal/yageodocoutput?fileName=/pdf/R-Chip/PYu-RC_Group_51_RoHS_L_4.pdf; ComponentLink1Description: http://www.yageo.com/NewPortal/yageodocoutput?fileName=/pdf/R-Chip/PYu-RC_Group_51_RoHS_L_4.pdf; Supplier Part Number 1: 311-10.0KLRCT-ND
R10 = RC0402FR-07100RL: RES SMD 100 OHM 1% 1/16W 0402; Manufacturer: Yageo; Resistance (Ohms): 100; Power (Watts): 0.063W, 1/16W; Temperature Coefficient: ±100ppm/°C; Supplier 1: Digi-Key; Manufacturer Part Number: RC0402FR-07100RL; RoHS: RoHS Compliant; Category: Resistors; Stock 1: 4498031; Pricing 1: 1=0.1, 10=0.013, 25=0.0096, 100=0.0054, 250=0.00412, 500=0.00328, 1000=0.00242, 2500=0.0021, 5000=0.00173 (USD); Packaging: Cut Tape (CT); Part Status: Active; Tolerance: ±1%; Composition: Thick Film; Features: Moisture Resistant; Operating Temperature: -55°C ~ 155°C; Package / Case: 0402 (1005 Metric); Supplier Device Package: 0402; Size / Dimension: 0.039" L x 0.020" W (1.00mm x 0.50mm); Height - Seated (Max): 0.016" (0.40mm); Number of Terminations: 2; Failure Rate: -; ComponentLink1URL: http://www.yageo.com/NewPortal/yageodocoutput?fileName=/pdf/R-Chip/PYu-RC_Group_51_RoHS_L_4.pdf; ComponentLink1Description: http://www.yageo.com/NewPortal/yageodocoutput?fileName=/pdf/R-Chip/PYu-RC_Group_51_RoHS_L_4.pdf; Supplier Part Number 1: 311-100LRCT-ND
U1 = STM32F74XNXH: as U1 on sheet Sheet1; Copyright: Copyright (C) 2016 Accelerated Designs. All rights reserved; RefDes: RefDes; Type: Type; Value: Value; Supplier 1: Digi-Key; Manufacturer: STMicroelectronics; RoHS: RoHS Compliant; Category: Integrated Circuits (ICs); Stock 1: 825; Pricing 1: 1=17.07, 10=15.687, 100=13.2486, 500=11.7856 (USD); Packaging: Tray; Part Status: Active; EEPROM Size: -; Operating Temperature: -40°C ~ 85°C (TA); Package / Case: 216-TFBGA; Supplier Device Package: 216-TFBGA (13x13); ComponentLink1Description: http://www.st.com/content/ccc/resource/technical/document/datasheet/96/ed/61/9b/e0/6c/45/0b/DM00166116.pdf/files/DM00166116.pdf/jcr:content/translations/en.DM00166116.pdf; Supplier Part Number 1: 497-15818-ND
X1 = ASEMB-25.000MHZ-LC-T: OSC MEMS 25.000MHZ CMOS SMD; Manufacturer: Abracon LLC; Frequency: 25MHz; Function: Enable/Disable; Voltage - Supply: 1.8 V ~ 3.3 V; Frequency Stability: ±50ppm; Current - Supply (Max): 16mA; Current - Supply (Disable) (Max): 15µA; Supplier 1: Digi-Key; Manufacturer Part Number: ASEMB-25.000MHZ-LC-T; RoHS: RoHS Compliant; Category: Crystals, Oscillators, Resonators; Stock 1: 27584; Pricing 1: 1=1.14, 10=1.088, 50=1.0626, 100=0.9108, 500=0.8855 (USD); Packaging: Cut Tape (CT); Part Status: Active; Type: MEMS (Silicon); Output: CMOS; Operating Temperature: -40°C ~ 85°C; Ratings: -; Mounting Type: Surface Mount; Package / Case: 4-SMD, No Lead (DFN, LCC); Size / Dimension: 0.126" L x 0.098" W (3.20mm x 2.50mm); Height - Seated (Max): 0.035" (0.90mm); ComponentLink1URL: http://www.abracon.com/Oscillators/ASEMB.pdf; ComponentLink1Description: http://www.abracon.com/Oscillators/ASEMB.pdf; Supplier Part Number 1: 535-11750-1-ND
X2 = NX3215SA-32.768K-STD-MUA-14: CRYSTAL 32.7680KHZ 6PF SMD; Manufacturer: NDK; Frequency: 32.768kHz; Frequency Tolerance: ±20ppm; ESR (Equivalent Series Resistance): 70 kOhm; Operating Mode: Fundamental; Supplier 1: Digi-Key; Manufacturer Part Number: NX3215SA-32.768K-STD-MUA-14; RoHS: RoHS Compliant; Category: Crystals, Oscillators, Resonators; Stock 1: 5426; Pricing 1: 1=0.94, 10=0.835, 50=0.7804, 100=0.6897, 500=0.6534, 1000=0.5445 (USD); Packaging: Cut Tape (CT); Part Status: Active; Type: kHz Crystal (Tuning Fork); Frequency Stability: -; Load Capacitance: 6pF; Operating Temperature: -40°C ~ 85°C; Ratings: -; Mounting Type: Surface Mount; Package / Case: 2-SMD; Size / Dimension: 0.126" L x 0.059" W (3.20mm x 1.50mm); Height - Seated (Max): 0.035" (0.90mm); ComponentLink1URL: http://www.ndk.com/images/products/catalog/c_NX3215SA-STD-MUA-14_e.pdf; ComponentLink1Description: http://www.ndk.com/images/products/catalog/c_NX3215SA-STD-MUA-14_e.pdf; Supplier Part Number 1: 644-1171-1-ND